# EAGLE design CAMERA (EAGLE 9.5.0)

## Sheet 1 of 2: STM32
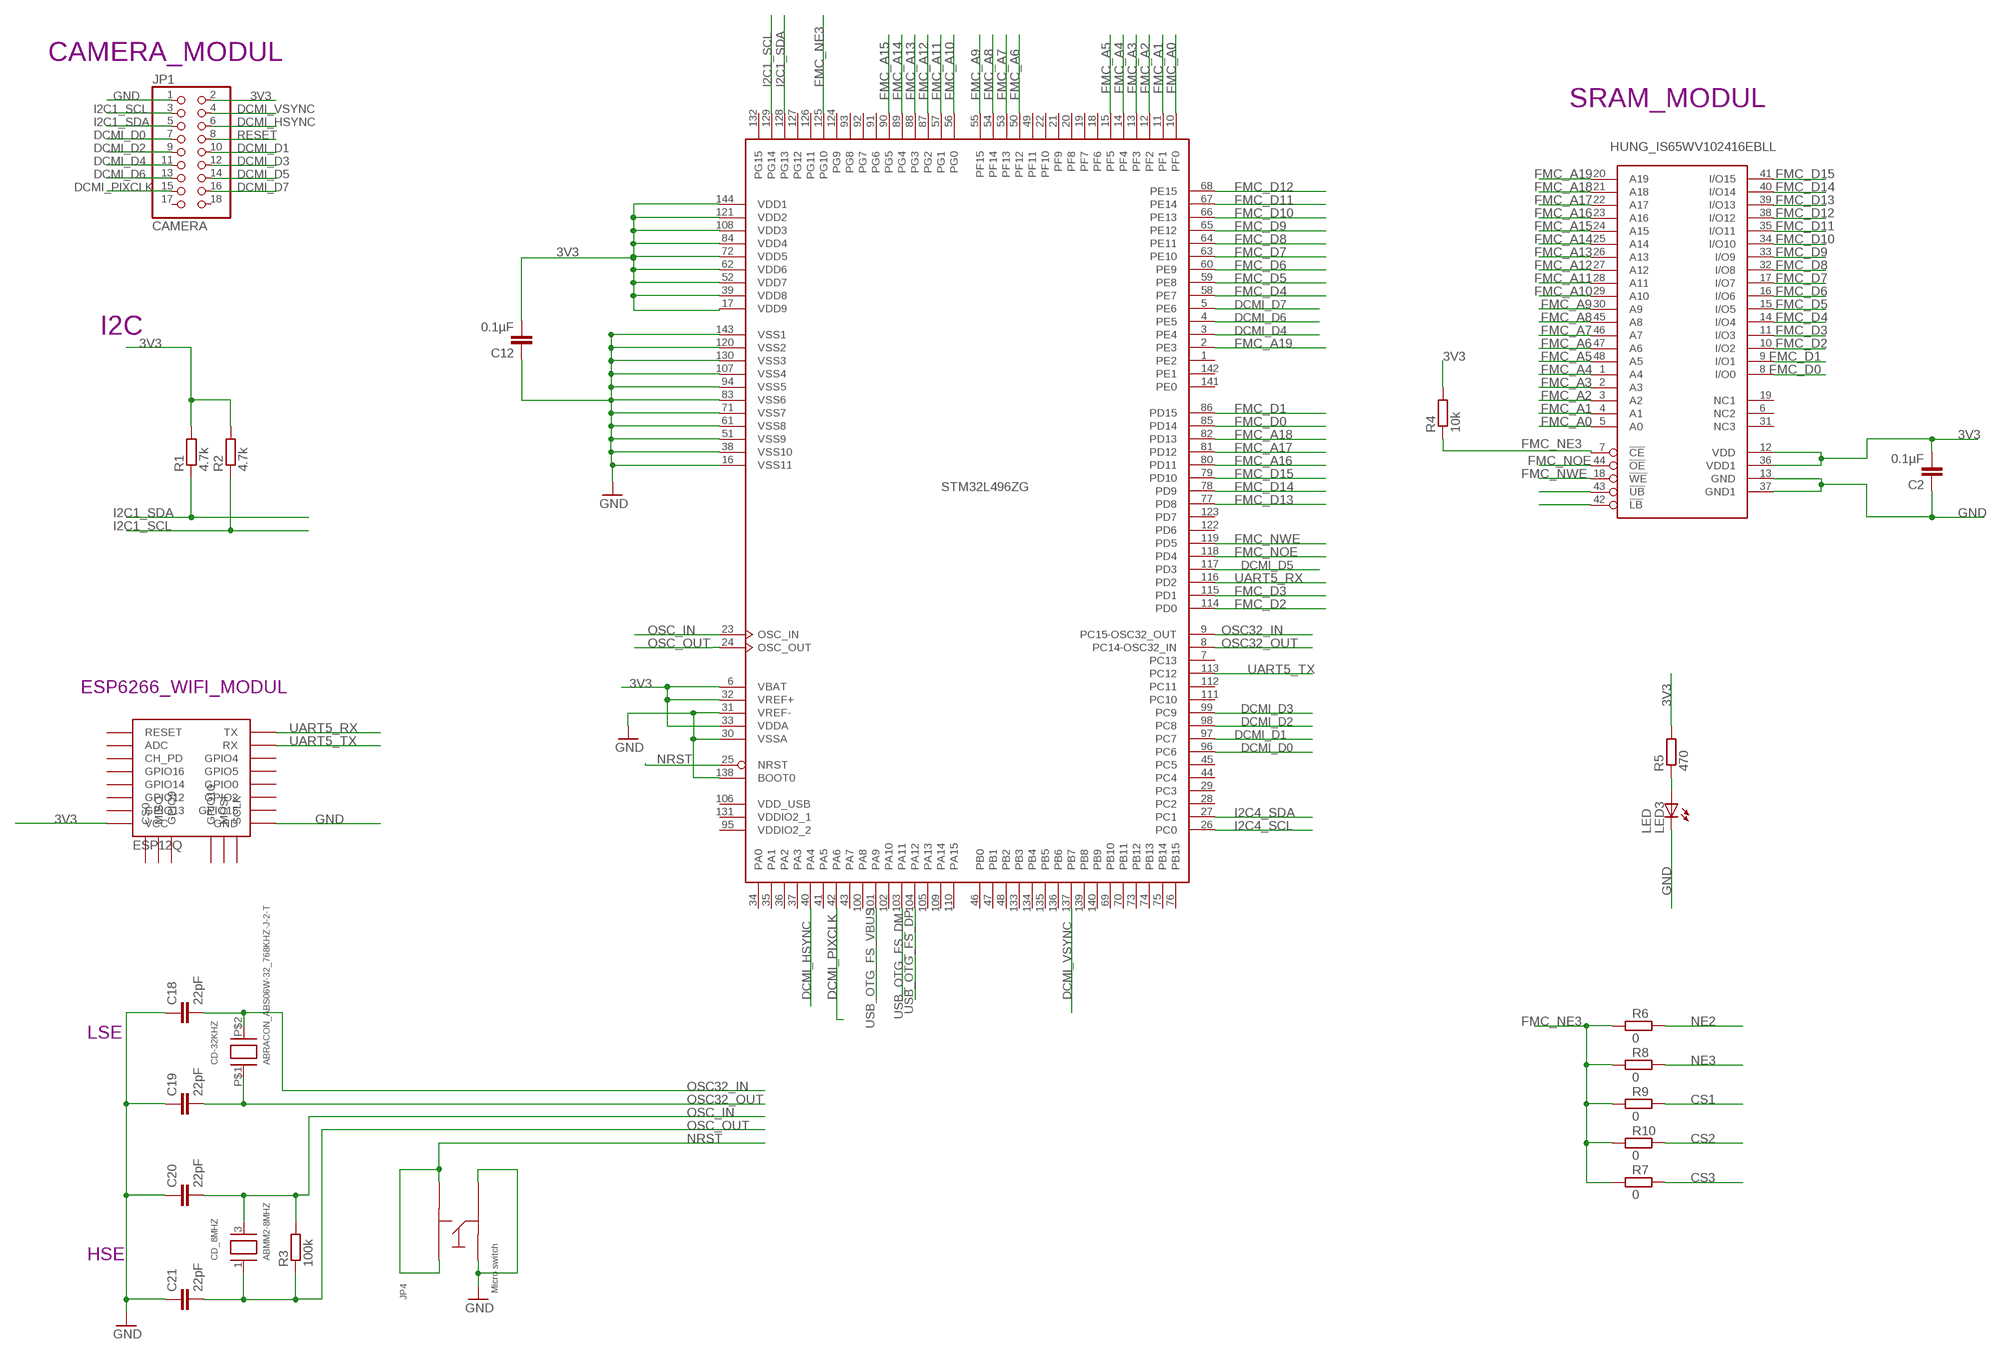
[diagram p0: schematic, sheet 1]

### Parts
C2  0.1µF  C-EUC0402K  [C0402K]
C12  0.1µF  C-EUC0402K  [C0402K]
C18  22pF  C-EUC0402K  [C0402K]
C19  22pF  C-EUC0402K  [C0402K]
C20  22pF  C-EUC0402K  [C0402K]
C21  22pF  C-EUC0402K  [C0402K]
CD-32KHZ  ABRACON_ABS06W-32_768KHZ-J-2-T  [2MM_X_1_2MM]
CD_8MHZ  ABMM2-8MHZ  [CRYSTAL_ABRACON_6MM_3.6MM]
JP1  CAMERA  PINHD-2X9  [2X09]
JP4  MICRO_SWITCH_6MM  [SKQGADE010]
LED3  LED  [0603_AK]
R1  4.7k  R_0402WEB_0402  [C0402K]
R2  4.7k  R_0402WEB_0402  [C0402K]
R3  100k  R_0402WEB_0402  [C0402K]
R4  10k  R_0402WEB_0402  [C0402K]
R5  470  R-EU_R0402  [R0402]
R6  0  R-EU_R0402  [R0402]
R7  0  R-EU_R0402  [R0402]
R8  0  R-EU_R0402  [R0402]
R9  0  R-EU_R0402  [R0402]
R10  0  R-EU_R0402  [R0402]
STM32L496ZG  STM32L496ZGT  [LQFP144]
U$1  HUNG_IS65WV102416EBLL  [TSOP-I-48-12X40MM]
U$2  ESP12Q  [ESP12Q]

### Nets
3V3: C2.2 C12.2 JP1.2 R1.2 R2.2 R4.2 R5.2 STM32L496ZG.6(VBAT) STM32L496ZG.17(VDD9) STM32L496ZG.32(VREF+) STM32L496ZG.33(VDDA) STM32L496ZG.39(VDD8) STM32L496ZG.52(VDD7) STM32L496ZG.62(VDD6) STM32L496ZG.72(VDD5) STM32L496ZG.84(VDD4) STM32L496ZG.108(VDD3) STM32L496ZG.121(VDD2) STM32L496ZG.144(VDD1) U$1.12(VDD) U$1.36(VDD1) U$2.VCC ; also sheet 2
CS1: R9.2
CS2: R10.2
CS3: R7.2
DCMI_D0: JP1.7 STM32L496ZG.96(PC6)
DCMI_D1: JP1.10 STM32L496ZG.97(PC7)
DCMI_D2: JP1.9 STM32L496ZG.98(PC8)
DCMI_D3: JP1.12 STM32L496ZG.99(PC9)
DCMI_D4: JP1.11 STM32L496ZG.3(PE4)
DCMI_D5: JP1.14 STM32L496ZG.117(PD3)
DCMI_D6: JP1.13 STM32L496ZG.4(PE5)
DCMI_D7: JP1.16 STM32L496ZG.5(PE6)
DCMI_HSYNC: JP1.6 STM32L496ZG.40(PA4)
DCMI_PIXCLK: JP1.15 STM32L496ZG.42(PA6)
DCMI_VSYNC: JP1.4 STM32L496ZG.137(PB7)
FMC_A0: STM32L496ZG.10(PF0) U$1.5(A0)
FMC_A1: STM32L496ZG.11(PF1) U$1.4(A1)
FMC_A2: STM32L496ZG.12(PF2) U$1.3(A2)
FMC_A3: STM32L496ZG.13(PF3) U$1.2(A3)
FMC_A4: STM32L496ZG.14(PF4) U$1.1(A4)
FMC_A5: STM32L496ZG.15(PF5) U$1.48(A5)
FMC_A6: STM32L496ZG.50(PF12) U$1.47(A6)
FMC_A7: STM32L496ZG.53(PF13) U$1.46(A7)
FMC_A8: STM32L496ZG.54(PF14) U$1.45(A8)
FMC_A9: STM32L496ZG.55(PF15) U$1.30(A9)
FMC_A10: STM32L496ZG.56(PG0) U$1.29(A10)
FMC_A11: STM32L496ZG.57(PG1) U$1.28(A11)
FMC_A12: STM32L496ZG.87(PG2) U$1.27(A12)
FMC_A13: STM32L496ZG.88(PG3) U$1.26(A13)
FMC_A14: STM32L496ZG.89(PG4) U$1.25(A14)
FMC_A15: STM32L496ZG.90(PG5) U$1.24(A15)
FMC_A16: STM32L496ZG.80(PD11) U$1.23(A16)
FMC_A17: STM32L496ZG.81(PD12) U$1.22(A17)
FMC_A18: STM32L496ZG.82(PD13) U$1.21(A18)
FMC_A19: STM32L496ZG.2(PE3) U$1.20(A19)
FMC_D0: STM32L496ZG.85(PD14) U$1.8(I/O0)
FMC_D1: STM32L496ZG.86(PD15) U$1.9(I/O1)
FMC_D2: STM32L496ZG.114(PD0) U$1.10(I/O2)
FMC_D3: STM32L496ZG.115(PD1) U$1.11(I/O3)
FMC_D4: STM32L496ZG.58(PE7) U$1.14(I/O4)
FMC_D5: STM32L496ZG.59(PE8) U$1.15(I/O5)
FMC_D6: STM32L496ZG.60(PE9) U$1.16(I/O6)
FMC_D7: STM32L496ZG.63(PE10) U$1.17(I/O7)
FMC_D8: STM32L496ZG.64(PE11) U$1.32(I/O8)
FMC_D9: STM32L496ZG.65(PE12) U$1.33(I/O9)
FMC_D10: STM32L496ZG.66(PE13) U$1.34(I/O10)
FMC_D11: STM32L496ZG.67(PE14) U$1.35(I/O11)
FMC_D12: STM32L496ZG.68(PE15) U$1.38(I/O12)
FMC_D13: STM32L496ZG.77(PD8) U$1.39(I/O13)
FMC_D14: STM32L496ZG.78(PD9) U$1.40(I/O14)
FMC_D15: STM32L496ZG.79(PD10) U$1.41(I/O15)
FMC_NBL0: U$1.42(!LB)
FMC_NBL1: U$1.43(!UB)
FMC_NE3: R4.1 R6.1 R7.1 R8.1 R9.1 R10.1 STM32L496ZG.125(PG10) U$1.7(!CE)
FMC_NOE: STM32L496ZG.118(PD4) U$1.44(!OE)
FMC_NWE: STM32L496ZG.119(PD5) U$1.18(!WE)
GND: C2.1 C12.1 C18.1 C19.1 C20.1 C21.1 JP1.1 JP4.P$3 JP4.P$4 LED3.K(C) STM32L496ZG.16(VSS11) STM32L496ZG.30(VSSA) STM32L496ZG.31(VREF-) STM32L496ZG.38(VSS10) STM32L496ZG.51(VSS9) STM32L496ZG.61(VSS8) STM32L496ZG.71(VSS7) STM32L496ZG.83(VSS6) STM32L496ZG.94(VSS5) STM32L496ZG.107(VSS4) STM32L496ZG.120(VSS2) STM32L496ZG.130(VSS3) STM32L496ZG.138(BOOT0) STM32L496ZG.143(VSS1) U$1.13(GND) U$1.37(GND1) U$2.GND ; also sheet 2
I2C1_SCL: JP1.3 R2.1 STM32L496ZG.129(PG14)
I2C1_SDA: JP1.5 R1.1 STM32L496ZG.128(PG13)
I2C4_SCL: STM32L496ZG.26(PC0) ; also sheet 2
I2C4_SDA: STM32L496ZG.27(PC1) ; also sheet 2
N$11: LED3.A R5.1
NE2: R6.2
NE3: R8.2
NRST: JP4.P$1 JP4.P$2 STM32L496ZG.25(NRST)
OSC32_IN: C18.2 CD-32KHZ.P$2(C1) STM32L496ZG.9(PC15-OSC32_OUT)
OSC32_OUT: C19.2 CD-32KHZ.P$1(C0) STM32L496ZG.8(PC14-OSC32_IN)
OSC_IN: C20.2 CD_8MHZ.3(C1) R3.2 STM32L496ZG.23(OSC_IN)
OSC_OUT: C21.2 CD_8MHZ.1(C0) R3.1 STM32L496ZG.24(OSC_OUT)
RESET: JP1.8
UART5_RX: STM32L496ZG.116(PD2) U$2.TX
UART5_TX: STM32L496ZG.113(PC12) U$2.RX
USB_OTG_FS_DM: STM32L496ZG.103(PA11) ; also sheet 2
USB_OTG_FS_DP: STM32L496ZG.104(PA12) ; also sheet 2
USB_OTG_FS_VBUS: STM32L496ZG.101(PA9) ; also sheet 2
Unconnected: JP1.17 JP1.18 STM32L496ZG.1(PE2) STM32L496ZG.7(PC13) STM32L496ZG.18(PF6) STM32L496ZG.19(PF7) STM32L496ZG.20(PF8) STM32L496ZG.21(PF9) STM32L496ZG.22(PF10) STM32L496ZG.28(PC2) STM32L496ZG.29(PC3) STM32L496ZG.34(PA0) STM32L496ZG.35(PA1) STM32L496ZG.36(PA2) STM32L496ZG.37(PA3) STM32L496ZG.41(PA5) STM32L496ZG.43(PA7) STM32L496ZG.44(PC4) STM32L496ZG.45(PC5) STM32L496ZG.46(PB0) STM32L496ZG.47(PB1) STM32L496ZG.48(PB2) STM32L496ZG.49(PF11) STM32L496ZG.69(PB10) STM32L496ZG.70(PB11) STM32L496ZG.73(PB12) STM32L496ZG.74(PB13) STM32L496ZG.75(PB14) STM32L496ZG.76(PB15) STM32L496ZG.91(PG6) STM32L496ZG.92(PG7) STM32L496ZG.93(PG8) STM32L496ZG.95(VDDIO2_2) STM32L496ZG.100(PA8) STM32L496ZG.102(PA10) STM32L496ZG.105(PA13) STM32L496ZG.106(VDD_USB) STM32L496ZG.109(PA14) STM32L496ZG.110(PA15) STM32L496ZG.111(PC10) STM32L496ZG.112(PC11) STM32L496ZG.122(PD6) STM32L496ZG.123(PD7) STM32L496ZG.124(PG9) STM32L496ZG.126(PG11) STM32L496ZG.127(PG12) STM32L496ZG.131(VDDIO2_1) STM32L496ZG.132(PG15) STM32L496ZG.133(PB3) STM32L496ZG.134(PB4) STM32L496ZG.135(PB5) STM32L496ZG.136(PB6) STM32L496ZG.139(PB8) STM32L496ZG.140(PB9) STM32L496ZG.141(PE0) STM32L496ZG.142(PE1) U$1.6(NC2) U$1.19(NC1) U$1.31(NC3) U$2.ADC U$2.CH_PD U$2.CS0 U$2.GPIO0 U$2.GPIO2 U$2.GPIO4 U$2.GPIO5 U$2.GPIO9 U$2.GPIO10 U$2.GPIO12 U$2.GPIO13 U$2.GPIO14 U$2.GPIO15 U$2.GPIO16 U$2.MISO U$2.MOSI U$2.RESET U$2.SCLK

### Notes on the sheet
- CAMERA_MODUL
- SRAM_MODUL
- I2C
- ESP6266_WIFI_MODUL
- LSE
- HSE

## Sheet 2 of 2
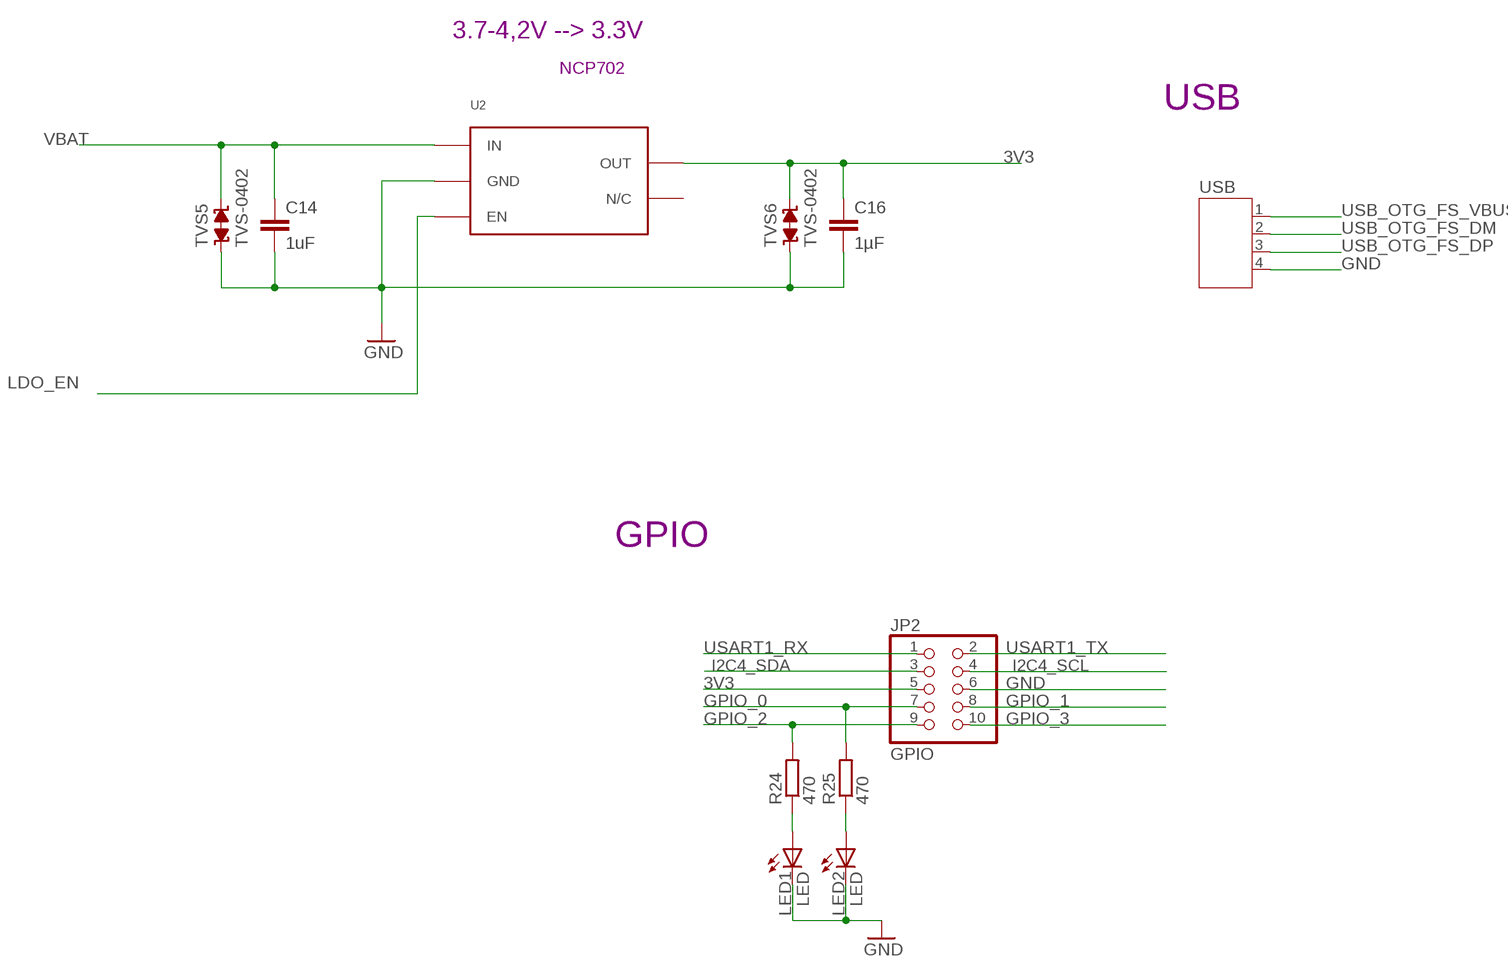
[diagram p1: schematic, sheet 2]

### Parts
C14  1uF  C-EUC0402K  [C0402K]
C16  1µF  C-EUC0402K  [C0402K]
JP2  GPIO  PINHD-2X5  [2X05]
LED1  LED  [0603_AK]
LED2  LED  [0603_AK]
R24  470  R-EU_R0402  [R0402]
R25  470  R-EU_R0402  [R0402]
TVS5  TVS-0402  [TVS0402]
TVS6  TVS-0402  [TVS0402]
U2  NCP702  [SOT563]
USB  JST-PH4  [JST-PH4]

### Nets
3V3: C16.1 JP2.5 TVS6.2 U2.P$5(OUT) ; also sheet 1
GND: C14.2 C16.2 JP2.6 LED1.K(C) LED2.K(C) TVS5.1 TVS6.1 U2.P$2(GND) USB.4 ; also sheet 1
GPIO_0: JP2.7 R25.2
GPIO_1: JP2.8
GPIO_2: JP2.9 R24.2
GPIO_3: JP2.10
I2C4_SCL: JP2.4 ; also sheet 1
I2C4_SDA: JP2.3 ; also sheet 1
LDO_EN: U2.P$3(EN)
N$8: LED1.A R24.1
N$9: LED2.A R25.1
USART1_RX: JP2.1
USART1_TX: JP2.2
USB_OTG_FS_DM: USB.2 ; also sheet 1
USB_OTG_FS_DP: USB.3 ; also sheet 1
USB_OTG_FS_VBUS: USB.1 ; also sheet 1
VBAT: C14.1 TVS5.2 U2.P$1(IN)
Unconnected: U2.P$4(N/C)

### Notes on the sheet
- 3.7-4,2V --> 3.3V
- NCP702
- USB
- GPIO

## Library data of the parts
C2 C12 C14 C16 C18-C21 = rcl:C-EU: CAPACITOR, European symbol; SPICEPREFIX: C
CD-32KHZ = sicom_universal:ABRACON_ABS06W-32_768KHZ-J-2-T
CD_8MHZ = sicom_universal:ABMM2-8MHZ; MPN: ABMM2-8.0000MHZ-E1-T
JP1 = pinhead:PINHD-2X9: PIN HEADER
JP2 = pinhead:PINHD-2X5: PIN HEADER
JP4 = sicom_universal:MICRO_SWITCH_6MM: Micro switch, suitable for CK 6mm components DigiKey <http://www.digikey.de/product-detail/de/PTS645SH50SMTR92%20LFS/CKN9085CT-ND/1146817>; MPN: SKQGABE010
LED1-LED3 = sicom_universal:LED; MPN: LB Q39G-L2OO-35-1
R1-R4 = sicom_universal:R_0402
R5-R10 R24 R25 = rcl:R-EU_: RESISTOR, European symbol; SPICEPREFIX: R
STM32L496ZG = micro-stm_v3:STM32L496ZG*T
TVS5 TVS6 = supressor:TVS-: TVS BI-DIRECTIONAL; MPN: GG0402050R3C2P
U2 = sicom_universal:NCP702: NCP702 200 mA, Ultra-Low Quiescent Current, Ultra-Low Noise, LDO Linear Voltage Regulator Noise sensitive applications such as Phase Locked Loops, Oscillators, Frequency Synthesizers, Low Noise Amplifiers and other Precision Instrumentation require very clean power supplies. The NCP702 is a 200 mA LDO that provides the engineer with a very stable, accurate voltage with ultra−low noise and very high Power Supply Rejection Ratio (PSRR), making it suitable for RF applications. The device doesn’t require an additional noise bypass capacitor to achieve ultra−low noise performance. In order to optimize performance for battery operated portable applications, the NCP702 employs an Adaptive Ground Current feature for ultra−low ground current consumption during light−load conditions.; MANUFACTURE_NUMBER: NCP702SN33T1G; MOUSER_PART_NUMBER: 863-NCP702SN33T1G; PACKAGE: TSOP-5
U$1 = memory-issi-asynsram:HUNG_IS65WV102416EBLL
U$2 = esp826612q:ESP12Q: ESP8266 Wifi module 12-Q
USB = sicom_universal:JST-PH4

## Board
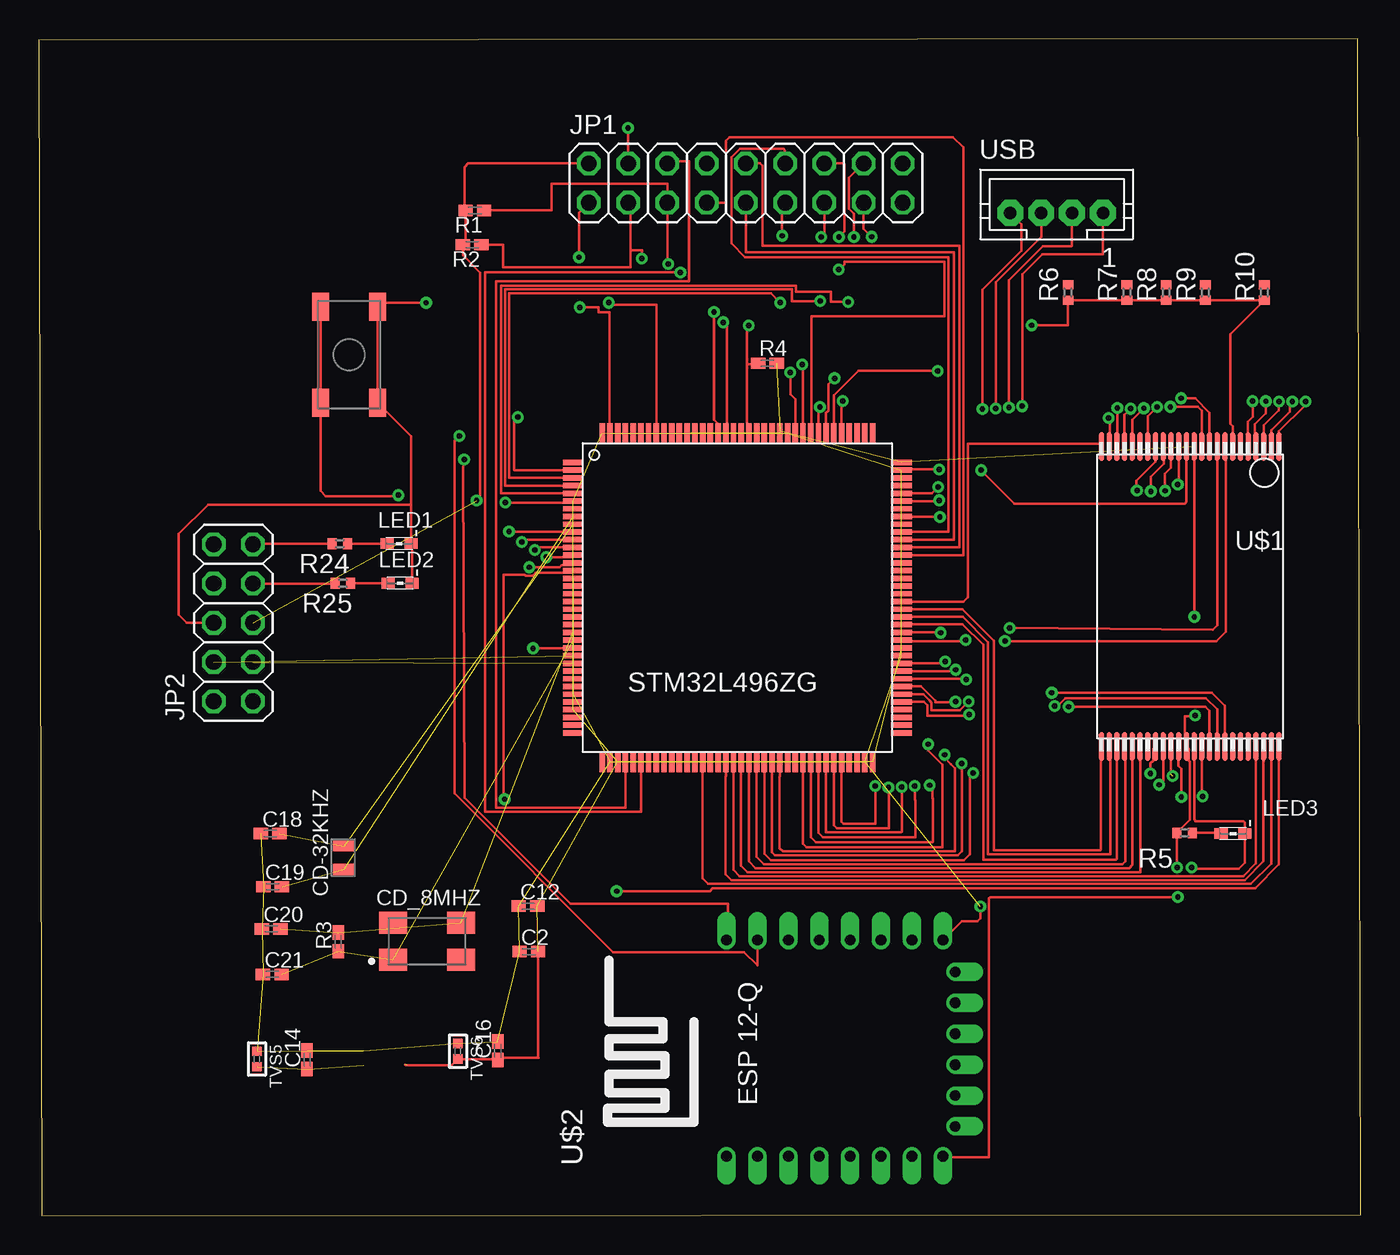
[diagram p2: board, top side]
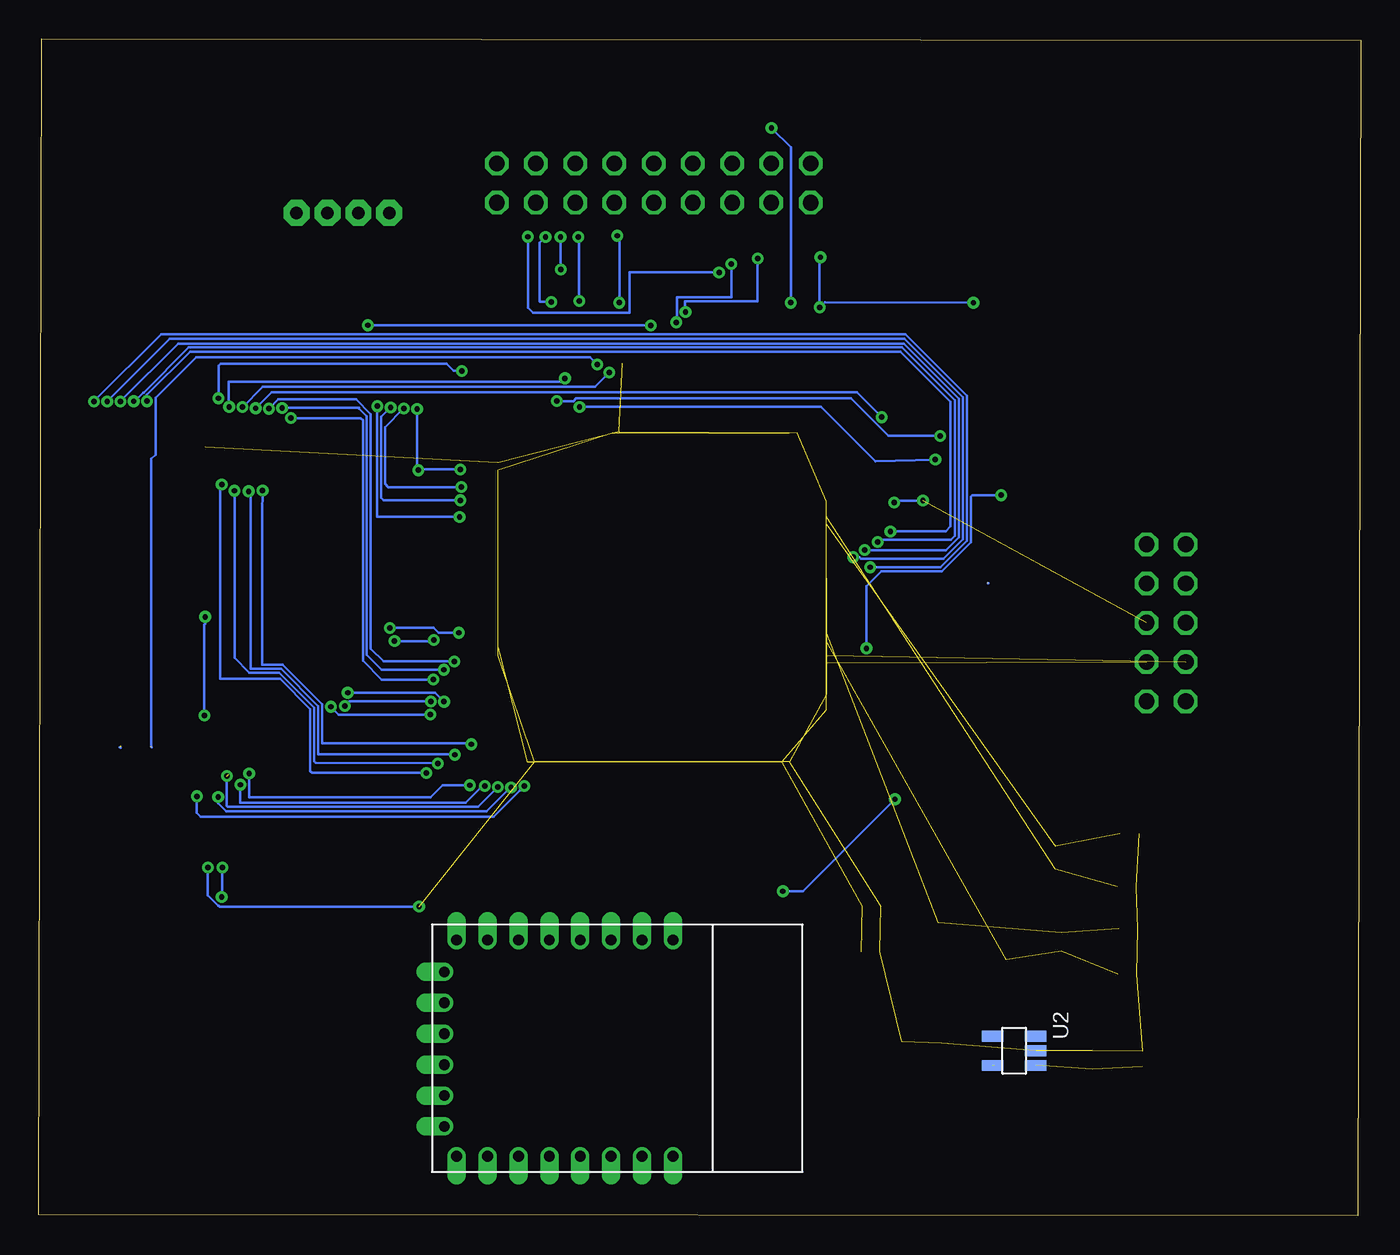
[diagram p3: board, bottom side, seen from below]

Size 85.61 x 76.2 mm. Coordinates in mm from the lower left corner, seen from the top.
Outline: 0.2,0 85.61,0.09 85.41,76.2 0,76.11 0.2,0
Copper layers (1*16): Top 0.035mm / dielectric 1.5mm / Bottom 0.035mm
Design rules "default *": minimum track width 6mil, minimum drill 0.35mm, track to track 4mil, track to pad 4mil, pad to pad 4mil, via to via 4mil, smd to smd 4mil, copper to edge 40mil, drill to drill 6mil, minimum pad ring 10mil, minimum via ring 8mil, stop-mask expansion 4mil, vias tented up to drill 0mil, thermal gap 10mil

### Footprints (pad centres in the part's own frame; a part is rotated, then mirrored left to right if it is on the bottom)
C0402K = smd 0.925 x 0.74: 1 -0.6,0; 2 0.6,0
2MM_X_1_2MM = smd 0.7 x 1.4: P$1 -0.75,0; P$2 0.75,0
CRYSTAL_ABRACON_6MM_3.6MM = smd 1.8 x 1.4: 1 -2.2,-1.2; 2 2.2,-1.2; 3 2.2,1.2; 4 -2.2,1.2
2X09 = drill 1.016 octagon: 1 -10.16,-1.27; 2 -10.16,1.27; 3 -7.62,-1.27; 4 -7.62,1.27; 5 -5.08,-1.27; 6 -5.08,1.27; 7 -2.54,-1.27; 8 -2.54,1.27; 9 0,-1.27; 10 0,1.27; 11 2.54,-1.27; 12 2.54,1.27; 13 5.08,-1.27; 14 5.08,1.27; 15 7.62,-1.27; 16 7.62,1.27; 17 10.16,-1.27; 18 10.16,1.27
2X05 = drill 1.016 octagon: 1 -5.08,-1.27; 2 -5.08,1.27; 3 -2.54,-1.27; 4 -2.54,1.27; 5 0,-1.27; 6 0,1.27; 7 2.54,-1.27; 8 2.54,1.27; 9 5.08,-1.27; 10 5.08,1.27
SKQGADE010 = smd 1.8 x 1.1: P$1 -3.1,1.85; P$2 3.1,1.85; P$3 -3.1,-1.85; P$4 3.1,-1.85
0603_AK = smd 0.85 x 0.7: A -0.775,0; K 0.775,0
R0402 = smd 0.6 x 0.7: 1 -0.5,0; 2 0.5,0
LQFP144 = smd 0.35 x 1.35: 1 -8.75,-10.625; 2 -8.25,-10.625; 3 -7.75,-10.625; 4 -7.25,-10.625; 5 -6.75,-10.625; 6 -6.25,-10.625; 7 -5.75,-10.625; 8 -5.25,-10.625; 9 -4.75,-10.625; 10 -4.25,-10.625; 11 -3.75,-10.625; 12 -3.25,-10.625; 13 -2.75,-10.62; 14 -2.25,-10.625; 15 -1.75,-10.625; 16 -1.25,-10.625; 17 -0.75,-10.625; 18 -0.25,-10.625; 19 0.25,-10.625; 20 0.75,-10.625; 21 1.25,-10.625; 22 1.75,-10.625; 23 2.25,-10.625; 24 2.75,-10.62; 25 3.25,-10.625; 26 3.75,-10.625; 27 4.25,-10.625; 28 4.75,-10.625; 29 5.25,-10.625; 30 5.75,-10.625; 31 6.25,-10.625; 32 6.75,-10.625; 33 7.25,-10.625; 34 7.75,-10.625; 35 8.25,-10.625; 36 8.75,-10.625; 73 8.75,10.625; 74 8.25,10.625; 75 7.75,10.625; 76 7.25,10.625; 77 6.75,10.625; 78 6.25,10.625; 79 5.75,10.625; 80 5.25,10.625; 81 4.75,10.625; 82 4.25,10.625; 83 3.75,10.625; 84 3.25,10.625; 85 2.75,10.625; 86 2.25,10.625; 87 1.75,10.625; 88 1.25,10.625; 89 0.75,10.625; 90 0.25,10.625; 91 -0.25,10.625; 92 -0.75,10.625; 93 -1.25,10.625; 94 -1.75,10.625; 95 -2.25,10.625; 96 -2.75,10.625; 97 -3.25,10.625; 98 -3.75,10.625; 99 -4.25,10.625; 100 -4.75,10.625; 101 -5.25,10.625; 102 -5.75,10.625; 103 -6.25,10.625; 104 -6.75,10.625; 105 -7.25,10.625; 106 -7.75,10.625; 107 -8.25,10.625; 108 -8.75,10.625 | smd 1.35 x 0.35: 37 10.625,-8.75; 38 10.625,-8.25; 39 10.625,-7.75; 40 10.625,-7.25; 41 10.625,-6.75; 42 10.625,-6.25; 43 10.625,-5.75; 44 10.625,-5.25; 45 10.625,-4.75; 46 10.625,-4.25; 47 10.625,-3.75; 48 10.625,-3.25; 49 10.625,-2.75; 50 10.625,-2.25; 51 10.625,-1.75; 52 10.625,-1.25; 53 10.625,-0.75; 54 10.625,-0.25; 55 10.625,0.25; 56 10.625,0.75; 57 10.625,1.25; 58 10.625,1.75; 59 10.625,2.25; 60 10.625,2.75; 61 10.625,3.25; 62 10.625,3.75; 63 10.625,4.25; 64 10.625,4.75; 65 10.625,5.25; 66 10.625,5.75; 67 10.625,6.25; 68 10.625,6.75; 69 10.625,7.25; 70 10.625,7.75; 71 10.625,8.25; 72 10.625,8.75; 109 -10.625,8.75; 110 -10.625,8.25; 111 -10.625,7.75; 112 -10.625,7.25; 113 -10.625,6.75; 114 -10.625,6.25; 115 -10.625,5.75; 116 -10.625,5.25; 117 -10.625,4.75; 118 -10.625,4.25; 119 -10.625,3.75; 120 -10.625,3.25; 121 -10.625,2.75; 122 -10.625,2.25; 123 -10.625,1.75; 124 -10.625,1.25; 125 -10.625,0.75; 126 -10.625,0.25; 127 -10.625,-0.25; 128 -10.625,-0.75; 129 -10.625,-1.25; 130 -10.625,-1.75; 131 -10.625,-2.25; 132 -10.625,-2.75; 133 -10.625,-3.25; 134 -10.625,-3.75; 135 -10.625,-4.25; 136 -10.625,-4.75; 137 -10.625,-5.25; 138 -10.625,-5.75; 139 -10.625,-6.25; 140 -10.625,-6.75; 141 -10.625,-7.25; 142 -10.625,-7.75; 143 -10.625,-8.25; 144 -10.625,-8.75
TVS0402 = smd 0.6 x 0.6: 1 -0.508,0; 2 0.508,0
SOT563 = smd 0.7 x 1.4: P$1 0.95,1.4; P$2 0,1.4; P$3 -0.95,1.4; P$4 -0.95,-1.4; P$5 0.95,-1.4
TSOP-I-48-12X40MM = smd 1.9 x 0.34: 1 -9.7,5.75; 2 -9.7,5.25; 3 -9.7,4.75; 4 -9.7,4.25; 5 -9.7,3.75; 6 -9.7,3.25; 7 -9.7,2.75; 8 -9.7,2.25; 9 -9.7,1.75; 10 -9.7,1.25; 11 -9.7,0.75; 12 -9.7,0.25; 13 -9.7,-0.25; 14 -9.7,-0.75; 15 -9.7,-1.25; 16 -9.7,-1.75; 17 -9.7,-2.25; 18 -9.7,-2.75; 19 -9.7,-3.25; 20 -9.7,-3.75; 21 -9.7,-4.25; 22 -9.7,-4.75; 23 -9.7,-5.25; 24 -9.7,-5.75; 25 9.7,-5.75; 26 9.7,-5.25; 27 9.7,-4.75; 28 9.7,-4.25; 29 9.7,-3.75; 30 9.7,-3.25; 31 9.7,-2.75; 32 9.7,-2.25; 33 9.7,-1.75; 34 9.7,-1.25; 35 9.7,-0.75; 36 9.7,-0.25; 37 9.7,0.25; 38 9.7,0.75; 39 9.7,1.25; 40 9.7,1.75; 41 9.7,2.25; 42 9.7,2.75; 43 9.7,3.25; 44 9.7,3.75; 45 9.7,4.25; 46 9.7,4.75; 47 9.7,5.25; 48 9.7,5.75
ESP12Q = drill 0.7 offset: ADC -7.1,3.8; CH_PD -7.1,1.8; CS0 -5.165,-9.005; GND 6.9,-8.2; GPIO0 6.9,-2.2; GPIO2 6.9,-4.2; GPIO4 6.9,1.8; GPIO5 6.9,-0.2; GPIO9 -1.165,-9.005; GPIO10 0.835,-9.005; GPIO12 -7.1,-4.2; GPIO13 -7.1,-6.2; GPIO14 -7.1,-2.2; GPIO15 6.9,-6.2; GPIO16 -7.1,-0.2; MISO -3.165,-9.005; MOSI 2.835,-9.005; RESET -7.1,5.8; RX 6.9,3.8; SCLK 4.835,-9.005; TX 6.9,5.8; VCC -7.1,-8.2
JST-PH4 = drill 0.813 pad 1.676 octagon: 1 3,0; 2 1,0; 3 -1,0; 4 -3,0

### Placement (x,y rotation side)
C2  31.74,17.11 0 top
C12  31.68,20.05 0 top
C14  17.38,10.11 90 top
C16  29.73,10.69 90 top
C18  14.99,24.75 0 top
C19  15.16,21.31 0 top
C20  15.06,18.58 0 top
C21  15.13,15.64 0 top
CD-32KHZ  19.77,23.19 90 top
CD_8MHZ  25.16,17.78 0 top
JP1  45.79,66.85 0 top
JP2  12.61,38.39 90 top
JP4  20.1,55.74 90 top
LED1  23.35,43.52 0 top
LED2  23.4,40.96 0 top
LED3  77.33,24.75 0 top
R1  28.24,65.08 180 top
R2  28.07,62.86 180 top
R3  19.4,17.74 90 top
R4  47.19,55.19 0 top
R5  74.2,24.79 180 top
R6  66.65,59.77 90 top
R7  70.46,59.77 90 top
R8  73,59.77 90 top
R9  75.54,59.77 90 top
R10  79.35,59.77 90 top
R24  19.51,43.51 180 top
R25  19.7,40.95 180 top
STM32L496ZG  45.24,40.02 270 top
TVS5  14.14,10.16 270 top
TVS6  27.15,10.66 270 top
U2  22.45,10.69 270 bottom
U$1  74.56,40.09 270 top
U$2  50.34,10.96 90 top
USB  65.91,64.92 0 top

### Tracks (layer width: path | path; a pad name or v marks a point on that pad's centre or on a via)
3V3  (via drill 0.35)  (18 unrouted)
  Top 0.152: U$1.12 v74.82,38.78 | v74.88,32.4 74.82,32.34 74.21,32.34 74.21,30.49 U$1.36 74.46,30.24 74.46,29.47 74.54,29.39 74.54,25.63 R5.2 v73.7,22.57 v73.71,22.56 | v73.76,20.64 61.62,20.64 61.53,20.55 61.53,3.79 58.61,3.79 U$2.VCC 58.54,3.16 | C2.2 32.34,10.25 32.36,10.23 29.87,10.23 C16.1 29.67,10.15 TVS6.2 26.75,9.75 23.79,9.75 23.74,9.8 | JP1.2 27.81,68.12 27.58,67.89 27.58,65.14 R1.2 27.64,63.03 R2.2 27.47,62.18 28.59,61.06 28.59,46.54 v28.35,46.3 | 47.99,50.73 48.04,50.78 | v30.22,46.17 34.52,46.17 STM32L496ZG.6
  Bottom 0.152: v74.82,38.78 74.82,38.33 74.89,38.27 74.88,38.07 v74.88,32.4 | v73.71,22.56 73.71,20.69 v73.76,20.64 | v28.35,46.3 30.09,46.3 v30.22,46.17
DCMI_D0
  Top 0.152: STM32L496ZG.96 59.86,42.77 59.86,69.17 59.2,69.83 44.74,69.83 44.49,69.58 44.49,65.65 44.42,65.58 JP1.7
DCMI_D1
  Top 0.152: STM32L496ZG.97 59.61,43.27 59.61,62.81 46.86,62.81 46.86,67.97 46.71,68.12 JP1.10
DCMI_D2
  Top 0.152: STM32L496ZG.98 59.26,43.77 59.26,62.36 45.79,62.36 JP1.9
DCMI_D3
  Top 0.152: STM32L496ZG.99 58.91,44.27 58.91,62.05 45.74,62.05 44.85,62.94 44.85,68.51 45.4,69.06 48.21,69.06 48.33,68.94 JP1.12
DCMI_D4  (via drill 0.35)
  Top 0.152: STM32L496ZG.3 30.46,47.77 30.46,59.71 47.41,59.71 v48.01,59.11 | v48.14,63.44 48.14,65.39 JP1.11
  Bottom 0.152: 48.03,59.13 v48.01,59.11 48.01,63.31 v48.14,63.44
DCMI_D5  (via drill 0.35)
  Top 0.152: STM32L496ZG.117 50.03,50.69 50.03,58.23 58.66,58.23 58.66,61.76 52.16,61.76 52.16,61.6 v51.81,61.25 | v51.82,63.37 52.18,63.73 52.18,68.06 52.12,68.12 JP1.14
  Bottom 0.152: v51.81,61.25 51.81,63.36 v51.82,63.37
DCMI_D6  (via drill 0.35)
  Top 0.152: STM32L496ZG.4 30.21,47.27 30.21,59.96 48.77,59.96 48.77,59.21 v50.61,59.21 | v50.67,63.37 50.87,63.57 JP1.13
  Bottom 0.152: v50.61,59.21 50.61,63.31 v50.67,63.37
DCMI_D7  (via drill 0.35)
  Top 0.152: STM32L496ZG.5 29.95,46.77 29.95,60.22 49.02,60.22 49.02,59.81 51.31,59.81 51.31,59.16 v52.41,59.16 | v52.79,63.37 52.79,64.87 52.47,65.19 52.47,67.18 JP1.16
  Bottom 0.152: v52.41,59.16 53.14,59.16 53.18,59.2 53.18,62.98 v52.79,63.37
DCMI_HSYNC
  Top 0.152: STM32L496ZG.40 37.99,26.41 29.61,26.41 29.61,60.51 42.11,60.51 42.11,68.26 40.71,68.26 JP1.6
DCMI_PIXCLK  (via drill 0.35)
  Top 0.152: STM32L496ZG.42 38.99,26.16 28.91,26.16 28.91,61.07 v41.55,61.07 | v53.93,63.38 53.41,63.9 JP1.15
  Bottom 0.152: v41.55,61.07 47.35,61.07 47.35,58.45 53.61,58.45 53.93,58.77 v53.93,63.38
DCMI_VSYNC  (via drill 0.35)
  Top 0.152: STM32L496ZG.137 39.99,58.96 37.06,58.96 v36.91,59.11 | v38.16,70.41 v38.17,70.4 JP1.4
  Bottom 0.152: v36.91,59.11 36.91,64.02 36.91,68.12 36.91,69.16 v38.16,70.41
FMC_A0  (via drill 0.35)
  Top 0.152: STM32L496ZG.10 30.5,44.27 v30.46,44.31 | v78.6,52.73 78.6,51.72 78.28,51.4 78.28,49.82 U$1.5
  Bottom 0.152: v30.46,44.31 26.88,44.31 26.56,44.63 26.56,52.7 29.8,55.94 75.8,55.94 78.6,53.14 v78.6,52.73
FMC_A1  (via drill 0.35)
  Top 0.152: STM32L496ZG.11 31.43,43.77 v31.29,43.63 | v79.45,52.73 79.45,51.94 78.75,51.24 78.75,49.85 U$1.4
  Bottom 0.152: v31.29,43.63 31.17,43.75 26.55,43.75 26.28,44.02 26.28,52.78 29.7,56.21 75.89,56.21 78.81,53.29 78.83,53.29 79.39,52.73 v79.45,52.73
FMC_A2  (via drill 0.35)
  Top 0.152: STM32L496ZG.12 32.4,43.27 32.22,43.1 v32.12,43.1 | v80.31,52.72 80.29,52.7 80.29,52.15 79.31,51.17 U$1.3
  Bottom 0.152: v32.12,43.1 31.9,43.1 31.87,43.07 26.87,43.07 26.02,43.92 26.02,52.89 29.6,56.46 76.57,56.46 v80.31,52.72
FMC_A3  (via drill 0.35)
  Top 0.152: STM32L496ZG.13 34.49,42.64 v32.88,42.64 | v81.17,52.72 81.15,52.72 81,52.57 81,52.05 79.81,50.86 U$1.2
  Bottom 0.152: v32.88,42.64 32.45,42.64 32.35,42.54 27.04,42.54 25.77,43.81 25.77,53 29.54,56.77 77.12,56.77 v81.17,52.72
FMC_A4  (via drill 0.35)
  Top 0.152: STM32L496ZG.14 34.47,42.12 33.87,42.12 33.73,41.98 v31.76,41.98 | v82.03,52.72 82.03,52.52 80.31,50.8 U$1.1
  Bottom 0.152: v31.76,41.98 27.24,41.98 25.51,43.71 25.51,53.1 29.5,57.08 77.67,57.08 v82.03,52.72
FMC_A5  (via drill 0.35)  (1 unrouted)
  Top 0.152: STM32L496ZG.15 34.47,41.62 32.19,41.62 31.99,41.43 31.53,41.43 31.45,41.51 30.11,41.51 30.11,27.03 v30.17,26.97 | v37.42,21.02 43.46,21.02 43.64,21.2 78.76,21.2 80.31,22.75 U$1.48
  Bottom 0.152: 80.3,30.29 80.36,30.35 | v30.17,26.97 36.12,21.02 v37.42,21.02
FMC_A6
  Top 0.152: STM32L496ZG.50 42.99,28.45 42.98,28.43 42.98,21.86 43.35,21.49 78.49,21.49 79.81,22.81 U$1.47
FMC_A7
  Top 0.152: STM32L496ZG.53 44.49,28.45 44.48,28.43 44.48,22.11 44.85,21.74 78.09,21.74 79.3,22.95 79.3,29.43 79.31,29.44 U$1.46
FMC_A8
  Top 0.152: STM32L496ZG.54 44.99,28.45 44.98,28.43 44.98,22.41 45.39,22 77.99,22 78.82,22.83 U$1.45
FMC_A9
  Top 0.152: STM32L496ZG.55 45.49,28.45 45.48,28.43 45.48,22.67 45.9,22.25 71.32,22.25 71.32,29.45 71.31,29.46 U$1.30
FMC_A10
  Top 0.152: STM32L496ZG.56 45.99,28.45 45.98,28.43 45.98,22.95 46.41,22.52 70.61,22.52 70.82,22.73 U$1.29
FMC_A11
  Top 0.152: STM32L496ZG.57 46.49,28.45 46.48,28.43 46.48,23.25 46.96,22.77 70.15,22.77 70.35,22.97 70.35,29.83 70.31,29.87 U$1.28
FMC_A12
  Top 0.152: STM32L496ZG.87 55.91,38.31 59.82,38.31 61.16,36.98 61.16,23.07 69.75,23.07 69.8,23.12 69.8,29.43 69.81,29.44 U$1.27
FMC_A13
  Top 0.152: STM32L496ZG.88 59.84,38.77 61.47,37.14 61.47,23.41 69.38,23.41 69.38,30.32 U$1.26
FMC_A14
  Top 0.152: STM32L496ZG.89 59.82,39.27 61.85,37.24 61.85,23.66 68.73,23.66 68.79,23.72 68.79,30.12 68.81,30.14 U$1.25
FMC_A15
  Top 0.152: STM32L496ZG.90 59.89,39.77 60.18,40.06 60.18,49.99 68.61,49.99 U$1.24
FMC_A16  (via drill 0.35)
  Top 0.152: STM32L496ZG.80 59.99,34.77 v60.05,34.71 | v69.28,51.65 69.37,51.56 U$1.23
  Bottom 0.152: v60.05,34.71 63.4,34.71 64.61,35.92 64.61,51.51 64.75,51.65 v69.28,51.65
FMC_A17  (via drill 0.35)
  Top 0.152: STM32L496ZG.81 59.29,35.27 v59.37,35.35 | v69.84,52.3 69.84,49.96 69.81,49.93 U$1.22
  Bottom 0.152: v59.37,35.35 63.39,35.35 64.36,36.32 64.36,51.75 64.87,52.26 64.87,52.3 v69.84,52.3
FMC_A18  (via drill 0.35)
  Top 0.152: STM32L496ZG.82 58.58,35.77 v58.7,35.89 | v70.7,52.25 70.31,51.86 U$1.21
  Bottom 0.152: v58.7,35.89 59.12,35.89 59.14,35.91 63.29,35.91 64.11,36.73 64.11,51.9 65.07,52.86 70.09,52.86 v70.7,52.25
FMC_A19  (via drill 0.35)
  Top 0.152: STM32L496ZG.2 30.81,48.27 30.78,48.3 30.78,51.46 v31.02,51.7 | v71.56,52.28 70.81,51.53 U$1.20
  Bottom 0.152: v31.02,51.7 32.62,53.3 70.54,53.3 v71.56,52.28
FMC_D0  (via drill 0.35)
  Top 0.152: STM32L496ZG.85 55.94,37.19 59.76,37.19 59.85,37.28 v60.03,37.28 | v62.57,37.21 76.26,37.21 76.87,37.82 76.87,49.73 U$1.8
  Bottom 0.152: v62.57,37.21 60.1,37.21 v60.03,37.28
FMC_D1  (via drill 0.35)
  Top 0.152: STM32L496ZG.86 58.38,37.77 v58.4,37.75 | v62.87,38.06 62.7,38.06 76.02,37.94 76.31,38.23 U$1.9
  Bottom 0.152: v58.4,37.75 59.71,37.75 60.02,38.06 v62.87,38.06
FMC_D2  (via drill 0.35)
  Top 0.152: STM32L496ZG.114 51.49,53.12 53.06,54.69 v58.21,54.69 | v73.96,52.93 74.88,52.93 75.81,52 U$1.10
  Bottom 0.152: v58.21,54.69 58.73,54.69 59.2,55.16 73.82,55.16 73.96,55.02 v73.96,52.93
FMC_D3  (via drill 0.35)
  Top 0.152: 51.04,50.7 STM32L496ZG.115 50.99,51.98 51.14,52.13 51.14,53.83 v51.53,54.22 | v73.27,52.37 75.04,52.37 75.31,52.1 U$1.11
  Bottom 0.152: v51.53,54.22 51.76,53.99 73.29,53.99 73.29,52.39 v73.27,52.37
FMC_D4  (via drill 0.35)
  Top 0.152: STM32L496ZG.58 46.99,28.45 46.98,28.43 46.98,23.46 47.41,23.03 59.92,23.03 60.29,23.4 60.29,28.46 v60.51,28.68 | v73.75,47.34 73.81,47.4 U$1.14
  Bottom 0.152: v60.51,28.68 67.91,28.68 68.02,28.79 68.02,32.8 69.98,34.76 73.86,34.76 73.86,47.23 v73.75,47.34
FMC_D5  (via drill 0.35)
  Top 0.152: STM32L496ZG.59 47.49,28.45 47.48,28.43 47.48,23.53 47.67,23.34 59.52,23.34 59.77,23.59 v59.77,29.29 | v72.93,46.94 72.93,48.05 73.32,48.44 U$1.15
  Bottom 0.152: 67.76,32.9 | 67.76,32.9 70.02,35.16 71.97,35.16 72.93,36.12 v72.93,46.94 | v59.77,29.29 67.66,29.34 67.77,29.44 67.77,32.89 67.76,32.9
FMC_D6  (via drill 0.35)
  Top 0.152: STM32L496ZG.60 47.99,28.45 47.98,28.43 47.98,23.8 48.18,23.6 59.32,23.6 59.32,28.96 59.08,29.25 58.65,29.68 v58.65,29.85 | 72.9,49.7 72.84,49.76 | v72.01,46.9 72.01,47.84 72.84,48.67 72.84,49.66 | 72.84,49.66 72.81,49.69 U$1.16 72.84,49.76 | 72.84,49.76 72.84,49.66
  Bottom 0.152: v58.65,29.85 58.7,29.9 59.98,29.9 59.99,29.89 67.5,29.89 67.5,33 69.92,35.41 71.87,35.41 71.87,46.76 v72.01,46.9
FMC_D7  (via drill 0.35)
  Top 0.152: STM32L496ZG.63 49.49,28.45 49.48,28.43 49.48,24.08 49.71,23.85 58.51,23.85 58.51,29.21 57.58,30.14 57.58,30.52 v57.59,30.53 | v71.11,46.95 71.05,47.01 71.08,47.19 71.08,47.57 72.31,48.8 U$1.17
  Bottom 0.152: v57.59,30.53 57.65,30.59 67.25,30.59 67.25,33.11 69.81,35.67 71.13,35.67 71.13,45.44 v71.11,46.95
FMC_D8  (via drill 0.35)
  Top 0.152: STM32L496ZG.64 49.99,24.52 50.33,24.18 57.86,24.18 57.89,24.21 57.89,27.03 57.87,27.04 57.87,27.69 v57.68,27.88 | v71.98,28.64 71.98,29.29 72.16,29.47 72.16,30.24 U$1.32
  Bottom 0.152: v57.68,27.88 59.45,27.88 60.22,27.1 71.98,27.1 v71.98,28.64
FMC_D9  (via drill 0.35)
  Top 0.152: STM32L496ZG.65 50.49,24.8 50.78,24.51 56.76,24.51 56.76,26.9 56.73,26.93 v56.73,27.82 | U$1.33 72.81,28.18 v72.54,27.91
  Bottom 0.152: v56.73,27.82 56.91,27.82 57.98,26.75 72.56,26.75 72.56,27.89 v72.54,27.91
FMC_D10  (via drill 0.35)  (1 unrouted)
  Top 0.152: STM32L496ZG.66 50.99,24.82 55.82,24.82 55.88,24.88 v55.88,27.77 | U$1.34 73.31,28.59
  Bottom 0.152: v55.88,27.77 v55.88,27.76 57.15,26.49 73.38,26.49 73.43,26.54 v73.43,28.47
FMC_D11  (via drill 0.35)
  Top 0.152: STM32L496ZG.67 51.49,25.3 51.69,25.1 55.05,25.1 55.05,27.75 55.04,27.74 v55.02,27.74 | v73.98,27.12 73.98,28.94 73.78,29.14 73.78,30.36 U$1.35
  Bottom 0.152: v55.02,27.74 55.04,27.72 55.08,27.72 56.59,26.21 73.48,26.21 73.98,26.71 v73.98,27.12
FMC_D12  (via drill 0.35)
  Top 0.152: STM32L496ZG.68 51.99,25.51 52.1,25.4 54.17,25.4 v54.17,27.82 v54.16,27.83 | v75.37,27.16 75.31,27.22 U$1.38
  Bottom 0.152: v54.16,27.83 54.47,27.53 54.47,27.51 56.15,25.83 75.11,25.83 75.37,26.09 v75.37,27.16
FMC_D13  (via drill 0.35)
  Top 0.152: v66.69,32.96 75.55,32.96 75.81,32.7 U$1.39 | STM32L496ZG.77 57.32,33.27 57.53,33.06 57.53,32.39 60.19,32.39 v60.25,32.45
  Bottom 0.152: v60.25,32.45 66.18,32.45 v66.69,32.96
FMC_D14  (via drill 0.35)
  Top 0.152: STM32L496ZG.78 57.28,33.77 57.68,33.37 57.82,33.23 57.82,32.73 59.64,32.73 v60.22,33.31 | v65.78,33.01 65.95,33.01 66.46,33.52 75.58,33.52 76.31,32.79 U$1.40
  Bottom 0.152: v60.22,33.31 65.48,33.31 v65.78,33.01
FMC_D15  (via drill 0.35)
  Top 0.152: STM32L496ZG.79 57.14,34.27 58.07,33.34 58.07,33.26 58.08,33.25 59.33,33.25 v59.36,33.29 | v65.6,33.86 75.96,33.86 76.81,33.01 U$1.41
  Bottom 0.152: v59.36,33.29 59.94,33.86 v65.6,33.86
FMC_NE3  (via drill 0.35)
  Top 0.152: U$1.7 77.31,51.12 77.16,51.27 77.16,57.08 R10.1 R9.1 R8.1 R7.1 R6.1 | R6.1 66.49,59.11 | STM32L496ZG.125 45.87,50.77 45.87,55.12 | v45.98,57.64 45.87,57.53 45.87,55.12 | R6.1 66.65,57.65 v64.3,57.65 | R4.1 46.52,55.12 45.87,55.12
  Bottom 0.152: v45.98,57.64 64.29,57.64 v64.3,57.65
FMC_NOE  (via drill 0.35)  (1 unrouted)
  Top 0.152: STM32L496ZG.118 49.49,55.04 v49.43,55.1
  Bottom 0.152: v49.43,55.1 49.91,55.58 75.41,55.58 78.04,52.95 78.04,50 78.04,49.99 78.04,49.27 78.31,49 78.31,30.36 78.28,30.33
FMC_NWE  (via drill 0.35)
  Top 0.152: STM32L496ZG.119 48.99,52.87 48.66,53.2 v48.66,54.59 | v72.42,52.35 71.81,51.74 U$1.18
  Bottom 0.152: v48.66,54.59 49.59,53.66 71.11,53.66 v72.42,52.35
GND  (via drill 0.35)  (26 unrouted)
  Top 0.152: STM32L496ZG.143 36.96,50.67 36.96,58.5 36.25,58.5 36.25,58.81 v35.04,58.81 | 24.21,43.52 LED1.K | 74.9,30.3 U$1.37 74.81,25.68 74.93,25.56 | 74.9,25.56 74.93,25.56 | 74.93,25.56 78,25.56 78.1,25.45 LED3.K 78.1,22.88 77.69,22.46 74.74,22.46 v74.65,22.55 | v60.97,20.03 60.97,19.27 60.79,19.09 59.77,19.09 U$2.GND | STM32L496ZG.107 55.92,48.32 v58.3,48.32 | 61.14,48.28 61.15,48.27 v61.02,48.27 63.18,46.11 74.2,46.11 74.31,46.22 U$1.13 | v34.99,62.05 34.99,64.94 JP1.1 | USB.4 63.64,64.19 63.64,62.47 61.11,59.94 v61.11,52.23 | v25.09,59.1 22.21,59.1 JP4.P$4 JP4.P$3 24.12,50.46 24.12,46.04 | 24.12,46.04 LED1.K | LED1.K 24.18,43.47 LED2.K | JP2.6 9.59,38.39 9.08,38.9 9.08,44.15 10.97,46.04 24.12,46.04
  Bottom 0.152: 24.11,40.95 24.16,40.95 | v74.65,22.55 74.65,20.75 73.99,20.09 73.94,20.09 73.88,20.03 v60.97,20.03 | v58.3,48.32 60.97,48.32 | 60.97,48.32 v61.02,48.27 | v34.99,62.05 35.04,62 v35.04,58.81 34.71,59.14 25.05,59.1 v25.09,59.1 | v61.11,52.23 61.11,48.46 60.97,48.32
GPIO_0
  Top 0.152: JP2.7 19.18,40.93 R25.2
GPIO_2
  Top 0.152: JP2.9 13.92,43.51 R24.2
I2C1_SCL  (via drill 0.35)
  Top 0.152: R2.1 30.06,62.86 30.06,61.41 38.31,61.41 38.31,62.51 | 38.31,62.51 38.31,65.58 JP1.3 | 38.31,62.51 39.06,62.51 v39.06,61.96 | v43.73,58.51 43.73,51.54 43.99,51.28 STM32L496ZG.129
  Bottom 0.152: v39.06,61.96 39.06,59.21 43.76,59.21 43.76,58.51 v43.73,58.51
I2C1_SDA  (via drill 0.35)
  Top 0.152: R1.1 33.21,65.08 33.21,66.81 40.71,66.81 JP1.5 40.71,61.62 v40.76,61.62 | v44.32,57.84 44.58,57.58 44.58,50.73 STM32L496ZG.128
  Bottom 0.152: v40.76,61.62 40.76,59.46 44.29,59.46 44.29,57.81 v44.32,57.84
I2C4_SCL  (1 unrouted)
I2C4_SDA  (1 unrouted)
N$8
  Top 0.152: R24.1 LED1.A
N$9
  Top 0.152: R25.1 LED2.A
N$11
  Top 0.152: R5.1 76.52,24.79 LED3.A
NRST  (via drill 0.35)
  Top 0.152: JP4.P$2 JP4.P$1 18.25,46.93 18.59,46.59 23.24,46.59 v23.3,46.65 | v32.01,36.74 34.59,36.74 STM32L496ZG.25
  Bottom 0.152: v23.3,46.65 25.16,46.65 25.26,46.55 25.26,43.6 27.13,41.73 31.05,41.73 32.01,40.77 v32.01,36.74
OSC32_IN  (2 unrouted)
OSC32_OUT  (2 unrouted)
OSC_IN  (3 unrouted)
OSC_OUT  (3 unrouted)
UART5_RX  (via drill 0.35)
  Top 0.152: STM32L496ZG.116 50.49,52.26 v50.59,52.36 | v27.55,48.96 27.55,48.76 27.47,48.47 27.57,27.07 34.44,20.2 44.63,20.2 44.63,17.95 U$2.TX
  Bottom 0.152: v50.59,52.36 34.96,52.36 31.44,48.84 31.44,48.85 v27.55,48.96
UART5_TX  (via drill 0.35)
  Top 0.152: STM32L496ZG.113 51.99,52.66 v52.07,52.74 | v27.23,50.48 26.93,50.19 26.93,27.35 37.2,17.08 45.68,17.08 46.54,16.22 U$2.RX
  Bottom 0.152: v52.07,52.74 50.99,52.74 50.82,52.92 33.02,52.92 30.59,50.48 v27.23,50.48
USB_OTG_FS_DM  (via drill 0.35)
  Top 0.152: STM32L496ZG.103 58.25,46.27 v58.3,46.32 | v62.82,52.33 62.82,60.55 65.02,62.75 66.88,62.75 66.91,62.78 USB.2
  Bottom 0.152: v58.3,46.32 63.28,46.32 63.43,46.47 63.43,51.73 v62.82,52.33
USB_OTG_FS_DP  (via drill 0.35)
  Top 0.152: STM32L496ZG.104 57.83,46.77 v58.24,47.18 | v61.96,52.27 61.96,60.43 64.91,63.38 USB.3
  Bottom 0.152: v58.24,47.18 62.97,47.18 63.17,47.38 63.17,51.06 v61.96,52.27
USB_OTG_FS_VBUS  (via drill 0.35)
  Top 0.152: STM32L496ZG.101 58.32,45.27 v58.35,45.24 | v63.68,52.41 63.68,60.94 65,62.26 68.9,62.26 68.91,62.27 USB.1
  Bottom 0.152: v58.35,45.24 63.68,45.24 | 63.68,45.24 63.69,45.25 | 63.68,45.24 v63.68,52.41
VBAT  (2 unrouted)